# EAGLE design MAR-smd (EAGLE 5.11)
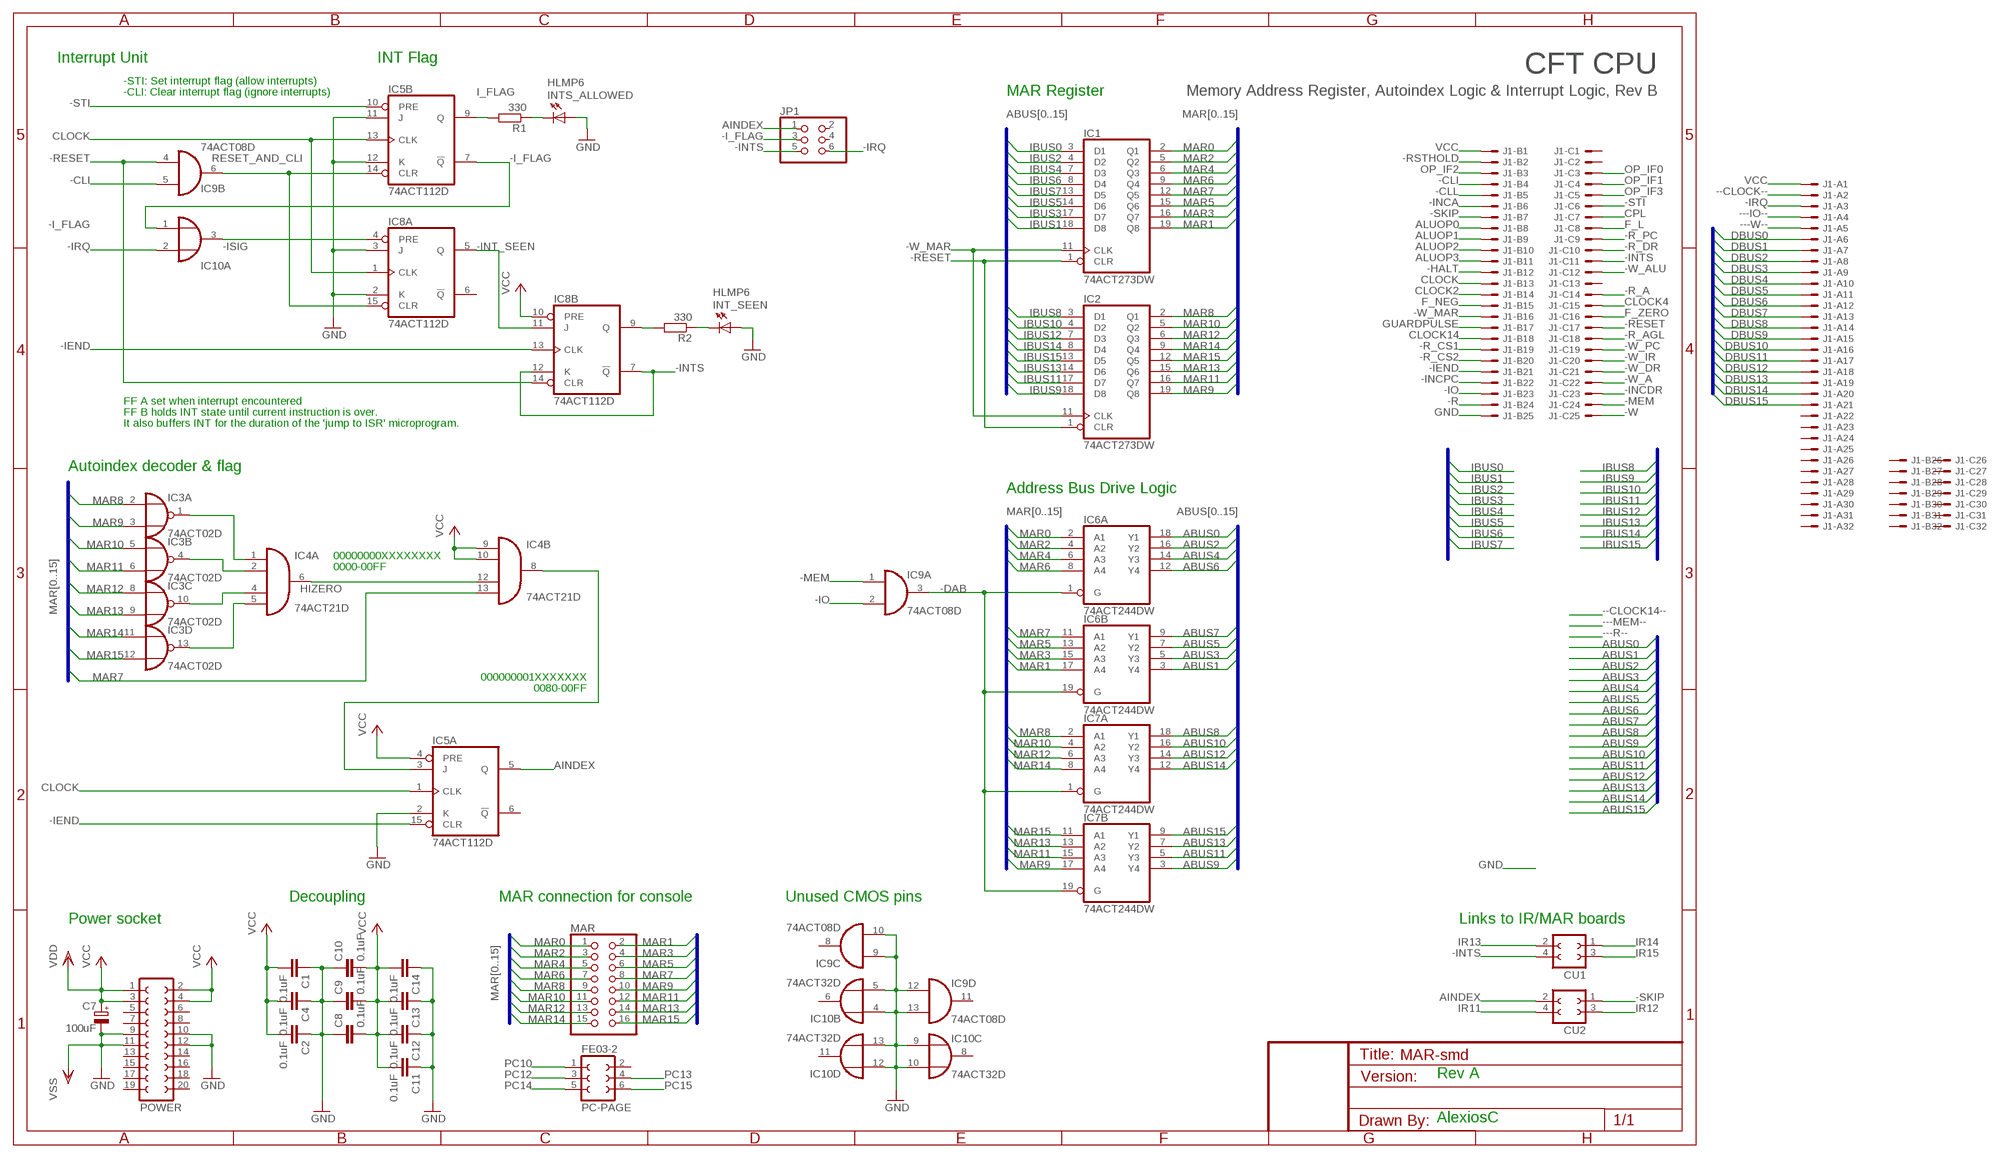
[diagram p0: schematic, sheet 1]

## Parts
C1  0.1uF  C-EU025-025X050  [C025-025X050]
C2  0.1uF  C-EU025-025X050  [C025-025X050]
C4  0.1uF  C-EU025-025X050  [C025-025X050]
C7  100uF  CPOL-EUE2.5-6  [E2,5-6]
C8  0.1uF  C-EU025-025X050  [C025-025X050]
C9  0.1uF  C-EU025-025X050  [C025-025X050]
C10  0.1uF  C-EU025-025X050  [C025-025X050]
C11  0.1uF  C-EU025-025X050  [C025-025X050]
C12  0.1uF  C-EU025-025X050  [C025-025X050]
C13  0.1uF  C-EU025-025X050  [C025-025X050]
C14  0.1uF  C-EU025-025X050  [C025-025X050]
CU1  FE02-2  [FE02-2]
CU2  FE02-2  [FE02-2]
IC1  74ACT273DW  [SO20W]
IC2  74ACT273DW  [SO20W]
IC3  74ACT02D  [SO14]
IC4  74ACT21D  [SO14]
IC5  74ACT112D  [SO16]
IC6  74ACT244DW  [SO20W]
IC7  74ACT244DW  [SO20W]
IC8  74ACT112D  [SO16]
IC9  74ACT08D  [SO14]
IC10  74ACT32D  [SO14]
INT_SEEN  HLMP6  [HLMP6]
INTS_ALLOWED  HLMP6  [HLMP6]
J1  VG96SB  [VG96B]
JP1  PINHD-2X3/90  [2X03/90]
MAR  PINHD-2X8/90  [2X08/90]
PC-PAGE  FE03-2  [FE03-2]
POWER  FE10-2  [FE10-2]
R1  330  R-EU_0204/7  [0204/7]
R2  330  R-EU_0204/7  [0204/7]

## Nets
---IO--: J1.A4
---W--: J1.A5
--CLOCK--: J1.A2
-CLI: IC9.5(B:I1) J1.B4
-CLL: J1.B5
-DAB: IC6.1(A:G) IC6.19(B:G) IC7.1(A:G) IC7.19(B:G) IC9.3(A:O)
-HALT: J1.B12
-I_FLAG: IC5.7(B:!Q) IC10.1(A:I0) JP1.3
-IEND: IC5.15(A:CLR) IC8.13(B:CLK) J1.B21
-INCA: J1.B6
-INCDR: J1.C23
-INCPC: J1.B22
-INT_SEEN: IC8.5(A:Q) IC8.11(B:J)
-INTS: CU1.4 IC8.7(B:!Q) IC8.12(B:K) J1.C11 JP1.5
-IO: IC9.2(A:I1) J1.B23
-IRQ: IC10.2(A:I1) J1.A3 JP1.6
-ISIG: IC8.4(A:PRE) IC10.3(A:O)
-MEM: IC9.1(A:I0) J1.C24
-R: J1.B24
-R_A: J1.C14
-R_AGL: J1.C18
-R_CS1: J1.B19
-R_CS2: J1.B20
-R_DR: J1.C10
-R_PC: J1.C9
-RESET: IC1.1(CLR) IC2.1(CLR) IC8.14(B:CLR) IC9.4(B:I0) J1.C17
-RSTHOLD: J1.B2
-SKIP: CU2.1 J1.B7
-STI: IC5.10(B:PRE) J1.C6
-W: J1.C25
-W_A: J1.C22
-W_ALU: J1.C12
-W_DR: J1.C21
-W_IR: J1.C20
-W_MAR: IC1.11(CLK) IC2.11(CLK) J1.B16
-W_PC: J1.C19
ABUS0: IC6.18(A:Y1)
ABUS1: IC6.3(B:Y4)
ABUS2: IC6.16(A:Y2)
ABUS3: IC6.5(B:Y3)
ABUS4: IC6.14(A:Y3)
ABUS5: IC6.7(B:Y2)
ABUS6: IC6.12(A:Y4)
ABUS7: IC6.9(B:Y1)
ABUS8: IC7.18(A:Y1)
ABUS9: IC7.3(B:Y4)
ABUS10: IC7.16(A:Y2)
ABUS11: IC7.5(B:Y3)
ABUS12: IC7.14(A:Y3)
ABUS13: IC7.7(B:Y2)
ABUS14: IC7.12(A:Y4)
ABUS15: IC7.9(B:Y1)
AINDEX: CU2.2 IC5.5(A:Q) JP1.1
ALUOP0: J1.B8
ALUOP1: J1.B9
ALUOP2: J1.B10
ALUOP3: J1.B11
CLOCK: IC5.1(A:CLK) IC5.13(B:CLK) IC8.1(A:CLK) J1.B13
CLOCK2: J1.B14
CLOCK4: J1.C15
CLOCK14: J1.B18
CPL: J1.C7
DBUS0: J1.A6
DBUS1: J1.A7
DBUS2: J1.A8
DBUS4: J1.A10
DBUS6: J1.A12
DBUS7: J1.A13
DBUS8: J1.A14
DBUS9: J1.A15
DBUS10: J1.A16
DBUS11: J1.A17
F_L: J1.C8
F_NEG: J1.B15
F_ZERO: J1.C16
GND [Power]: C1.1 C2.1 C4.1 C7.- C8.1 C9.1 C10.1 C11.1 C12.1 C13.1 C14.1 IC5.2(A:K) IC5.11(B:J) IC5.12(B:K) IC8.2(A:K) IC8.3(A:J) IC9.9(C:I0) IC9.10(C:I1) IC9.12(D:I0) IC9.13(D:I1) IC10.4(B:I0) IC10.5(B:I1) IC10.9(C:I0) IC10.10(C:I1) IC10.12(D:I0) IC10.13(D:I1) INT_SEEN.A INTS_ALLOWED.A J1.B25 POWER.9 POWER.10 POWER.11 POWER.12 ; supply symbol labelled VSS
GUARDPULSE: J1.B17
HIZERO: IC4.6(A:O) IC4.12(B:I2)
I_FLAG: IC5.9(B:Q) R1.2
IBUS0: IC1.3(D1)
IBUS1: IC1.18(D8)
IBUS2: IC1.4(D2)
IBUS3: IC1.17(D7)
IBUS4: IC1.7(D3)
IBUS5: IC1.14(D6)
IBUS6: IC1.8(D4)
IBUS7: IC1.13(D5)
IBUS8: IC2.3(D1)
IBUS9: IC2.18(D8)
IBUS10: IC2.4(D2)
IBUS11: IC2.17(D7)
IBUS12: IC2.7(D3)
IBUS13: IC2.14(D6)
IBUS14: IC2.8(D4)
IBUS15: IC2.13(D5)
INTS: IC8.9(B:Q) R2.2
IR11: CU2.4
IR12: CU2.3
IR13: CU1.2
IR14: CU1.1
IR15: CU1.3
MAR0: IC1.2(Q1) IC6.2(A:A1) MAR.1
MAR1: IC1.19(Q8) IC6.17(B:A4) MAR.2
MAR2: IC1.5(Q2) IC6.4(A:A2) MAR.3
MAR3: IC1.16(Q7) IC6.15(B:A3) MAR.4
MAR4: IC1.6(Q3) IC6.6(A:A3) MAR.5
MAR5: IC1.15(Q6) IC6.13(B:A2) MAR.6
MAR6: IC1.9(Q4) IC6.8(A:A4) MAR.7
MAR7: IC1.12(Q5) IC4.13(B:I3) IC6.11(B:A1) MAR.8
MAR8: IC2.2(Q1) IC3.2(A:I0) IC7.2(A:A1) MAR.9
MAR9: IC2.19(Q8) IC3.3(A:I1) IC7.17(B:A4) MAR.10
MAR10: IC2.5(Q2) IC3.5(B:I0) IC7.4(A:A2) MAR.11
MAR11: IC2.16(Q7) IC3.6(B:I1) IC7.15(B:A3) MAR.12
MAR12: IC2.6(Q3) IC3.8(C:I0) IC7.6(A:A3) MAR.13
MAR13: IC2.15(Q6) IC3.9(C:I1) IC7.13(B:A2) MAR.14
MAR14: IC2.9(Q4) IC3.11(D:I0) IC7.8(A:A4) MAR.15
MAR15: IC2.12(Q5) IC3.12(D:I1) IC7.11(B:A1) MAR.16
N$1: IC3.1(A:O) IC4.1(A:I0)
N$2: IC3.4(B:O) IC4.2(A:I1)
N$3: IC3.10(C:O) IC4.4(A:I2)
N$4: IC3.13(D:O) IC4.5(A:I3)
N$5: IC4.8(B:O) IC5.3(A:J)
N$6: INT_SEEN.K R2.1
N$7: INTS_ALLOWED.K R1.1
OP_IF0: J1.C3
OP_IF1: J1.C4
OP_IF2: J1.B3
OP_IF3: J1.C5
PC10: PC-PAGE.1
PC12: PC-PAGE.3
PC13: PC-PAGE.4
PC14: PC-PAGE.5
PC15: PC-PAGE.6
RESET_AND_CLI: IC5.14(B:CLR) IC8.15(A:CLR) IC9.6(B:O)
VCC: C1.2 C2.2 C4.2 C7.+ C8.2 C9.2 C10.2 C11.2 C12.2 C13.2 C14.2 IC4.9(B:I0) IC4.10(B:I1) IC5.4(A:PRE) IC8.10(B:PRE) J1.A1 J1.B1 POWER.1 POWER.2 POWER.3 POWER.4 ; supply symbol labelled VDD
Unconnected: IC5.6(A:!Q) IC8.6(A:!Q) IC9.8(C:O) IC9.11(D:O) IC10.6(B:O) IC10.8(C:O) IC10.11(D:O) J1.A9 J1.A11 J1.A18 J1.A19 J1.A20 J1.A21 J1.A22 J1.A23 J1.A24 J1.A25 J1.A26 J1.A27 J1.A28 J1.A29 J1.A30 J1.A31 J1.A32 J1.B26 J1.B27 J1.B28 J1.B29 J1.B30 J1.B31 J1.B32 J1.C1 J1.C2 J1.C13 J1.C26 J1.C27 J1.C28 J1.C29 J1.C30 J1.C31 J1.C32 JP1.2 JP1.4 PC-PAGE.2 POWER.5 POWER.6 POWER.7 POWER.8 POWER.13 POWER.14 POWER.15 POWER.16 POWER.17 POWER.18 POWER.19 POWER.20

## Buses
IBUS[0..15]
MAR[0..15]
ABUS[0..15]
DBUS[0..15]

## Notes on the sheet
- Interrupt Unit | INT Flag
- CFT CPU
- -STI: Set interrupt flag (allow interrupts)
- -CLI: Clear interrupt flag (ignore interrupts) | MAR Register | Memory Address Register, Autoindex Logic & Interrupt Logic, Rev B
- FF A set when interrupt encountered
- FF B holds INT state until current instruction is over.
- It also buffers INT for the duration of the 'jump to ISR' microprogram.
- Autoindex decoder & flag
- Address Bus Drive Logic
- 00000000XXXXXXXX
- 0000-00FF
- 000000001XXXXXXX
- 0080-00FF
- Decoupling | MAR connection for console | Unused CMOS pins
- Power socket | Links to IR/MAR boards
- Rev A
- AlexiosC

## Power pins joined to a net without a drawn wire
GND: IC1.10(GND) IC2.10(GND) IC3.7(P:GND) IC4.7(P:GND) IC5.8(P:GND) IC6.10(P:GND) IC7.10(P:GND) IC8.8(P:GND) IC9.7(P:GND) IC10.7(P:GND)
VCC: IC1.20(VCC) IC2.20(VCC) IC3.14(P:VCC) IC4.14(P:VCC) IC5.16(P:VCC) IC6.20(P:VCC) IC7.20(P:VCC) IC8.16(P:VCC) IC9.14(P:VCC) IC10.14(P:VCC)

## Library data of the parts
C1 C2 C4 C8-C14 = rcl:C-EU: CAPACITOR, European symbol
C7 = rcl:CPOL-EU: POLARIZED CAPACITOR, European symbol
CU1 CU2 = alexios:FE02-2: A 2x2 pin female header.
IC1 IC2 = 74xx-eu:74*273: Octal D type FLIP FLOP, clear
IC3 = 74xx-eu:74*02: Quad 2-input NOR gate
IC4 = 74xx-eu:74*21: Dual 4-input AND gate
IC5 IC8 = 74xx-eu:74*112: Dual J-K negative edge triggered FLIP FLOP, preset and clear
IC6 IC7 = 74xx-eu:74*244: Octal BUFFER and LINE DRIVER, 3-state
IC9 = 74xx-eu:74*08: Quad 2-input AND gate
IC10 = 74xx-eu:74*32: Quad 2-input OR gate
INT_SEEN INTS_ALLOWED = display-hp:HLMP6: LED 2mm horizontal; MF: AGILENT TECHNOLOGIES; MPN: HLMP-6500; OC_FARNELL: 1652490; OC_NEWARK: 40K0088
J1 = 19inch:VG96S: PCB EUROCARD, 96-pin type C/ABC, 2.54 mm
JP1 = pinhead:PINHD-2X3: PIN HEADER
MAR = pinhead:PINHD-2X8: PIN HEADER
PC-PAGE = alexios:FE03-2: A 2x3 female header.
POWER = con-lsta:FE10-2: FEMALE HEADER; OC_FARNELL: unknown; OC_NEWARK: unknown
R1 R2 = resistor:R-EU_: RESISTOR, European symbol

## Net classes
0 default: width 0.406 mm, clearance 0.305 mm
1 Decoupling: width 1.27 mm
2 Power: width 1.27 mm, clearance 0.61 mm

## Board
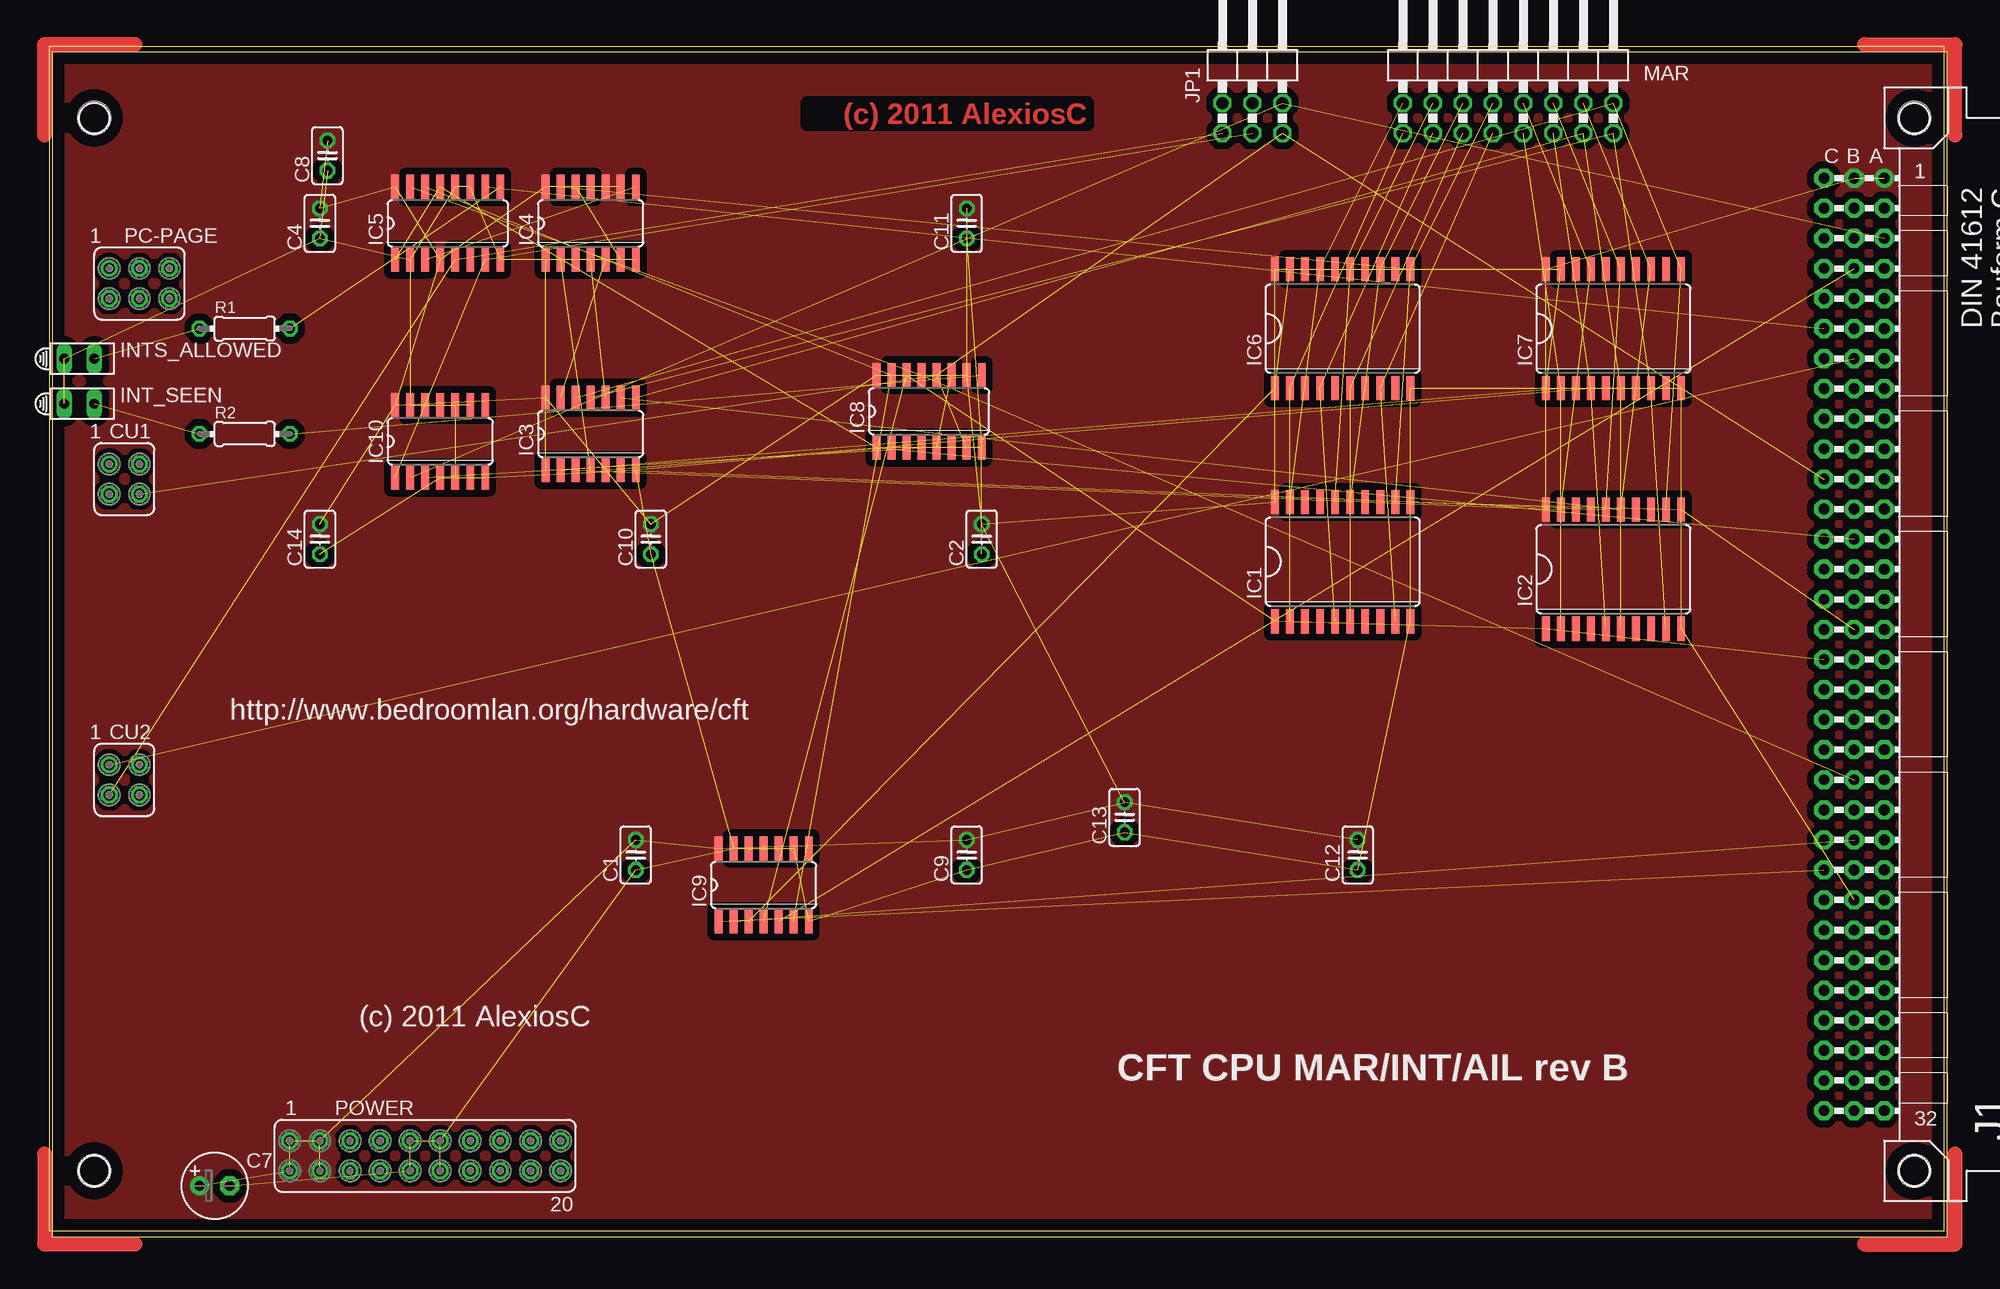
[diagram p1: board, top side]
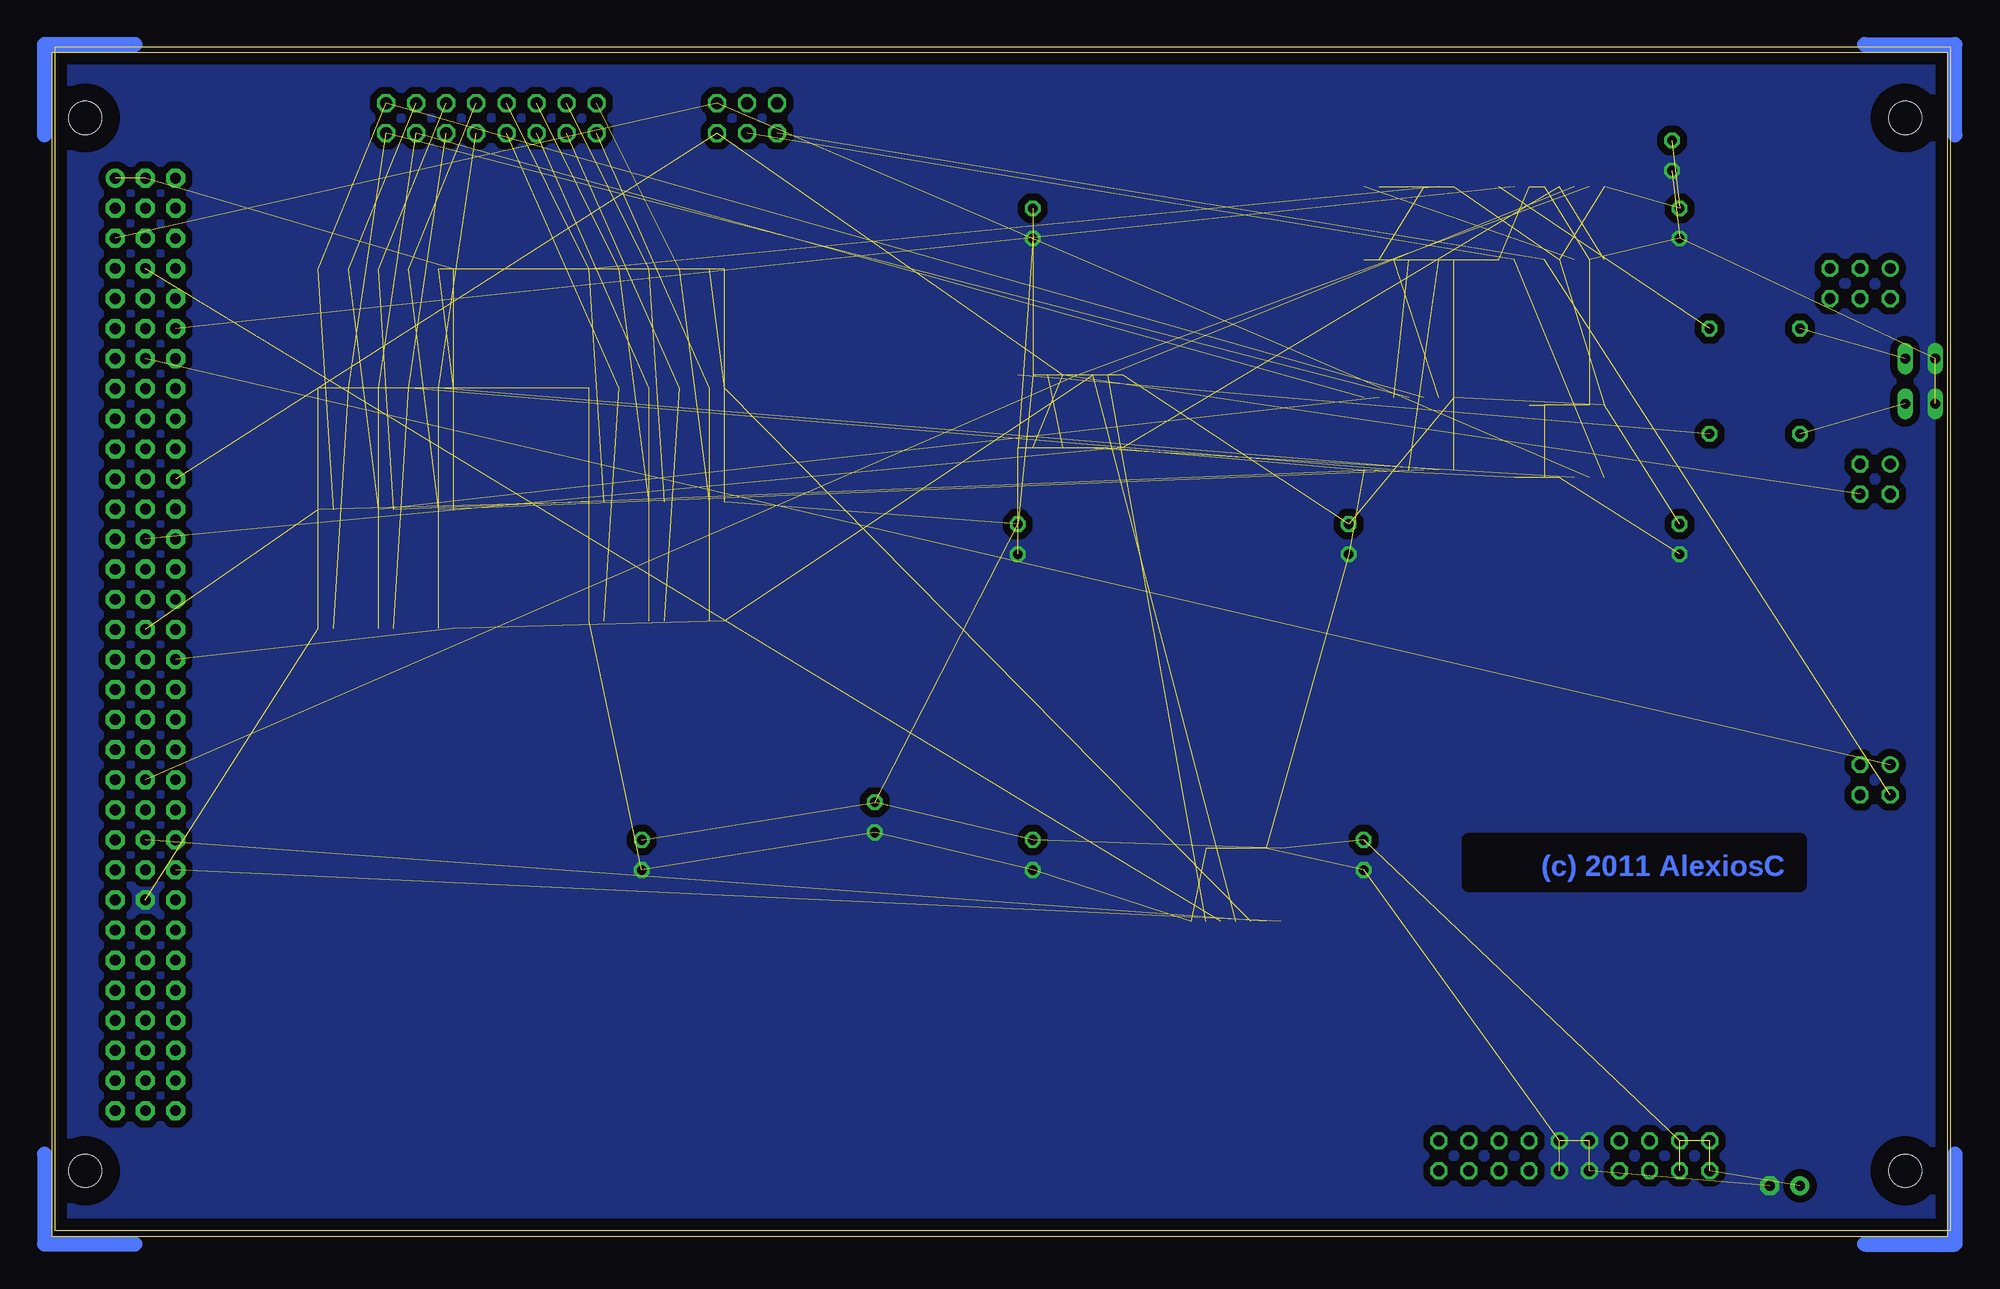
[diagram p2: board, bottom side, seen from below]

Size 160 x 100 mm. Coordinates in mm from the lower left corner, seen from the top.
Outline: 0,0 160,0 160,100 0,100 0,0
Copper layers (1*16): Top 0.035mm / dielectric 1.5mm / Bottom 0.035mm
Design rules "olimex-10mil *": minimum track width 10mil, minimum drill 24mil, track to track 10mil, track to pad 12mil, pad to pad 10mil, via to via 10mil, smd to smd 10mil, copper to edge 40mil, drill to drill 10mil, minimum pad ring 10mil, minimum via ring 8mil, stop-mask expansion 0mil, vias tented up to drill 0mil, thermal gap 10mil
bRestrict: area 12.7,29.2 to 40.6,33

### Footprints (pad centres in the part's own frame; a part is rotated, then mirrored left to right if it is on the bottom)
C025-025X050 = drill 0.813 octagon: 1 -1.27,0; 2 1.27,0
E2,5-6 = drill 0.813 pad 1.6 round: + -1.27,0 | drill 0.813 pad 1.6 octagon: - 1.27,0
FE02-2 = drill 0.914 round: 1 -1.27,1.27 | drill 0.914 octagon: 2 -1.27,-1.27; 3 1.27,1.27; 4 1.27,-1.27
SO20W = smd 0.66 x 2.032: 1 -5.715,-5.029; 2 -4.445,-5.029; 3 -3.175,-5.029; 4 -1.905,-5.029; 5 -0.635,-5.029; 6 0.635,-5.029; 7 1.905,-5.029; 8 3.175,-5.029; 9 4.445,-5.029; 10 5.715,-5.029; 11 5.715,5.029; 12 4.445,5.029; 13 3.175,5.029; 14 1.905,5.029; 15 0.635,5.029; 16 -0.635,5.029; 17 -1.905,5.029; 18 -3.175,5.029; 19 -4.445,5.029; 20 -5.715,5.029
SO14 = smd 0.66 x 2.032: 1 -3.81,-3.073; 2 -2.54,-3.073; 3 -1.27,-3.073; 4 0,-3.073; 5 1.27,-3.073; 6 2.54,-3.073; 7 3.81,-3.073; 8 3.81,3.073; 9 2.54,3.073; 10 1.27,3.073; 11 0,3.073; 12 -1.27,3.073; 13 -2.54,3.073; 14 -3.81,3.073
SO16 = smd 0.66 x 2.032: 1 -4.445,-3.073; 2 -3.175,-3.073; 3 -1.905,-3.073; 4 -0.635,-3.073; 5 0.635,-3.073; 6 1.905,-3.073; 7 3.175,-3.073; 8 4.445,-3.073; 9 4.445,3.073; 10 3.175,3.073; 11 1.905,3.073; 12 0.635,3.073; 13 -0.635,3.073; 14 -1.905,3.073; 15 -3.175,3.073; 16 -4.445,3.073
HLMP6 = drill 0.813 long: A -1.27,0; K 1.27,0
VG96B = drill 0.914 pad 1.6 round: A1 154.94,39.37 | drill 0.914 pad 1.6 octagon: A2 154.94,36.83; A3 154.94,34.29; A4 154.94,31.75; A5 154.94,29.21; A6 154.94,26.67; A7 154.94,24.13; A8 154.94,21.59; A9 154.94,19.05; A10 154.94,16.51; A11 154.94,13.97; A12 154.94,11.43; A13 154.94,8.89; A14 154.94,6.35; A15 154.94,3.81; A16 154.94,1.27; A17 154.94,-1.27; A18 154.94,-3.81; A19 154.94,-6.35; A20 154.94,-8.89; A21 154.94,-11.43; A22 154.94,-13.97; A23 154.94,-16.51; A24 154.94,-19.05; A25 154.94,-21.59; A26 154.94,-24.13; A27 154.94,-26.67; A28 154.94,-29.21; A29 154.94,-31.75; A30 154.94,-34.29; A31 154.94,-36.83; A32 154.94,-39.37; B1 152.4,39.37; B2 152.4,36.83; B3 152.4,34.29; B4 152.4,31.75; B5 152.4,29.21; B6 152.4,26.67; B7 152.4,24.13; B8 152.4,21.59; B9 152.4,19.05; B10 152.4,16.51; B11 152.4,13.97; B12 152.4,11.43; B13 152.4,8.89; B14 152.4,6.35; B15 152.4,3.81; B16 152.4,1.27; B17 152.4,-1.27; B18 152.4,-3.81; B19 152.4,-6.35; B20 152.4,-8.89; B21 152.4,-11.43; B22 152.4,-13.97; B23 152.4,-16.51; B24 152.4,-19.05; B25 152.4,-21.59; B26 152.4,-24.13; B27 152.4,-26.67; B28 152.4,-29.21; B29 152.4,-31.75; B30 152.4,-34.29; B31 152.4,-36.83; B32 152.4,-39.37; C1 149.86,39.37; C2 149.86,36.83; C3 149.86,34.29; C4 149.86,31.75; C5 149.86,29.21; C6 149.86,26.67; C7 149.86,24.13; C8 149.86,21.59; C9 149.86,19.05; C10 149.86,16.51; C11 149.86,13.97; C12 149.86,11.43; C13 149.86,8.89; C14 149.86,6.35; C15 149.86,3.81; C16 149.86,1.27; C17 149.86,-1.27; C18 149.86,-3.81; C19 149.86,-6.35; C20 149.86,-8.89; C21 149.86,-11.43; C22 149.86,-13.97; C23 149.86,-16.51; C24 149.86,-19.05; C25 149.86,-21.59; C26 149.86,-24.13; C27 149.86,-26.67; C28 149.86,-29.21; C29 149.86,-31.75; C30 149.86,-34.29; C31 149.86,-36.83; C32 149.86,-39.37 | hole 2.794: 157.48,44.45; 157.48,-44.45; 3.81,44.45; 3.81,-44.45
2X03/90 = drill 1.016 octagon: 1 -2.54,-6.35; 2 -2.54,-3.81; 3 0,-6.35; 4 0,-3.81; 5 2.54,-6.35; 6 2.54,-3.81
2X08/90 = drill 1.016 octagon: 1 -8.89,-6.35; 2 -8.89,-3.81; 3 -6.35,-6.35; 4 -6.35,-3.81; 5 -3.81,-6.35; 6 -3.81,-3.81; 7 -1.27,-6.35; 8 -1.27,-3.81; 9 1.27,-6.35; 10 1.27,-3.81; 11 3.81,-6.35; 12 3.81,-3.81; 13 6.35,-6.35; 14 6.35,-3.81; 15 8.89,-6.35; 16 8.89,-3.81
FE03-2 = drill 0.914 round: 1 -2.54,1.27 | drill 0.914 octagon: 2 -2.54,-1.27; 3 0,1.27; 4 0,-1.27; 5 2.54,1.27; 6 2.54,-1.27
FE10-2 = drill 0.914 octagon: 1 -11.43,1.27; 2 -11.43,-1.27; 3 -8.89,1.27; 4 -8.89,-1.27; 5 -6.35,1.27; 6 -6.35,-1.27; 7 -3.81,1.27; 8 -3.81,-1.27; 9 -1.27,1.27; 10 -1.27,-1.27; 11 1.27,1.27; 12 1.27,-1.27; 13 3.81,1.27; 14 3.81,-1.27; 15 6.35,1.27; 16 6.35,-1.27; 17 8.89,1.27; 18 8.89,-1.27; 19 11.43,1.27; 20 11.43,-1.27
0204/7 = drill 0.813 octagon: 1 -3.81,0; 2 3.81,0

### Placement (x,y rotation side)
C1  49.53,31.75 90 top
C2  78.74,58.42 90 top
C4  22.86,85.09 90 top
C7  13.97,3.81 0 top
C8  23.5,90.81 90 top
C9  77.47,31.75 90 top
C10  50.8,58.42 90 top
C11  77.47,85.09 90 top
C12  110.49,31.75 90 top
C13  90.81,34.92 90 top
C14  22.86,58.42 90 top
CU1  6.35,63.5 0 top
CU2  6.35,38.1 0 top
IC1  109.22,56.52 0 top
IC2  132.08,55.88 0 top
IC3  45.72,67.31 0 top
IC4  45.72,85.09 0 top
IC5  33.66,85.09 0 top
IC6  109.22,76.2 0 top
IC7  132.08,76.2 0 top
IC8  74.3,69.22 0 top
IC9  60.33,29.21 0 top
IC10  33.02,66.67 0 top
INT_SEEN  2.54,69.85 0 top
INTS_ALLOWED  2.54,73.66 0 top
J1  0,49.53 0 top
JP1  101.6,99.06 0 top
MAR  123.19,99.06 0 top
PC-PAGE  7.62,80.01 0 top
POWER  31.75,6.35 0 top
R1  16.51,76.2 0 top
R2  16.51,67.31 0 top

### Tracks (layer width: path | path; a pad name or v marks a point on that pad's centre or on a via)
-CLI  (1 unrouted)
-DAB  (4 unrouted)
-I_FLAG  (2 unrouted)
-IEND  (2 unrouted)
-INT_SEEN  (1 unrouted)
-INTS  (4 unrouted)
-IO  (1 unrouted)
-IRQ  (2 unrouted)
-ISIG  (1 unrouted)
-MEM  (1 unrouted)
-RESET  (4 unrouted)
-SKIP  (1 unrouted)
-STI  (1 unrouted)
-W_MAR  (2 unrouted)
AINDEX  (2 unrouted)
CLOCK  (3 unrouted)
GND  (42 unrouted)
  pour Bottom (isolate 0.508, no thermals): 30.48,8.89 29.21,7.62 29.21,5.08 30.48,3.81 33.02,3.81 34.29,5.08 34.29,7.62 33.02,8.89
  pour Bottom (isolate 0.61, no thermals): 0,100.33 0,0 160.02,0 160.02,100.33
HIZERO  (1 unrouted)
I_FLAG  (1 unrouted)
INTS  (1 unrouted)
MAR0  (2 unrouted)
MAR1  (2 unrouted)
MAR2  (2 unrouted)
MAR3  (2 unrouted)
MAR4  (2 unrouted)
MAR5  (2 unrouted)
MAR6  (2 unrouted)
MAR7  (3 unrouted)
MAR8  (3 unrouted)
MAR9  (3 unrouted)
MAR10  (3 unrouted)
MAR11  (3 unrouted)
MAR12  (3 unrouted)
MAR13  (3 unrouted)
MAR14  (3 unrouted)
MAR15  (3 unrouted)
N$1  (1 unrouted)
N$2  (1 unrouted)
N$3  (1 unrouted)
N$4  (1 unrouted)
N$5  (1 unrouted)
N$6  (1 unrouted)
N$7  (1 unrouted)
RESET_AND_CLI  (2 unrouted)
VCC  (30 unrouted)
  pour Top (isolate 0.508, no thermals): 20.32,8.89 19.05,7.62 19.05,5.08 20.32,3.81 22.86,3.81 24.13,5.08 24.13,7.62 22.86,8.89
  pour Top (isolate 0.61, rank 6, no thermals): 0,100.33 0,0 160.02,0 160.02,100.33

### Text on the board
Top: (c) 2011 AlexiosC
Bottom: (c) 2011 AlexiosC
tNames: http://www.bedroomlan.org/hardware/cft | (c) 2011 AlexiosC | CFT CPU MAR/INT/AIL rev B
tValues: +12V | +5V | GND